# EAGLE design TLV2361_breakout (EAGLE 9.3.1)
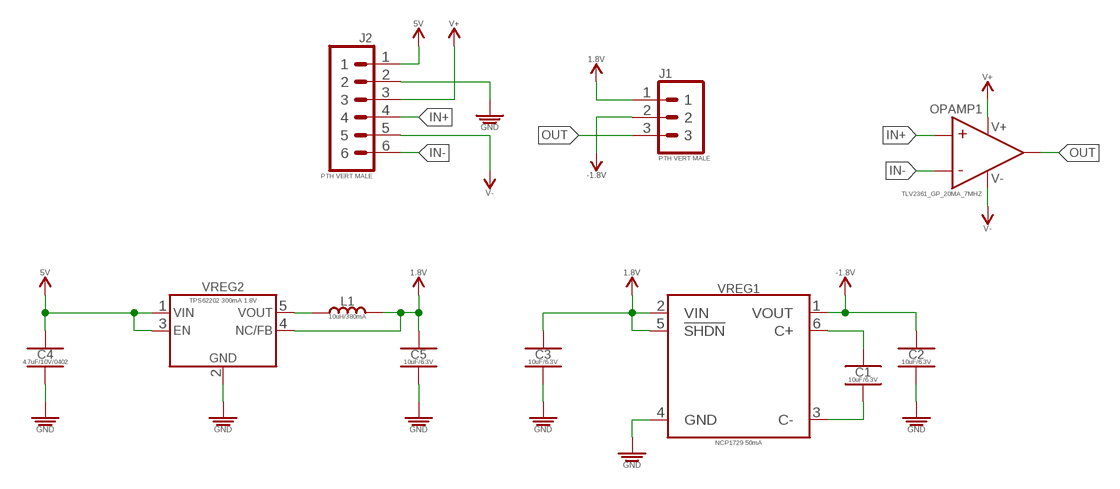
[diagram p0: schematic, sheet 1]

## Parts
C1  10uF/6.3V  10UF_CER_SMD-0402_6.3V-20%  [CAPC1005X55_SMD-0402]
C2  10uF/6.3V  10UF_CER_SMD-0402_6.3V-20%  [CAPC1005X55_SMD-0402]
C3  10uF/6.3V  10UF_CER_SMD-0402_6.3V-20%  [CAPC1005X55_SMD-0402]
C4  4.7uF/10V/0402  4.7UF_CER_SMD-0402_10V-20%  [CAPC1005X55_SMD-0402]
C5  10uF/6.3V  10UF_CER_SMD-0402_6.3V-20%  [CAPC1005X55_SMD-0402]
J1  PTH VERT MALE  1X03_PTH_VERT_MALE_2.54MM  [HDRV3W64P254_1X3_762X254X838B]
J2  PTH VERT MALE  1X06_PTH_VERT_MALE_2.54MM  [HDRV6W64P254_1X6_1524X254X838B]
L1  10uH/380mA  10UH_SMD-0603_0.38A-0.468OHM-10%  [INDC1608X60-0603]
OPAMP1  TLV2361_GP_20MA_7MHZ  [SOT95P280X145-5]
VREG1  NCP1729 50mA  VREG_NCP1729_NEGATIVE_SWITCHED-CAP-INVERTER_50MA  [SOT95P275X100-6]
VREG2  TPS62202 300mA 1.8V  VREG_SWITCHING_TPS6220XTPS62202_300MA_1.8V  [SOT95P280X145-5]

## Nets
1.8V: C3.1 C5.1 J1.1 L1.2 VREG1.2(VIN) VREG1.5(!SHDN) VREG2.4(NC/FB)
5V: C4.1 J2.1 VREG2.1(VIN) VREG2.3(EN)
-1.8V: C2.1 J1.2 VREG1.1(VOUT)
C+: C1.1 VREG1.6(C+)
C-: C1.2 VREG1.3(C-)
GND: C2.2 C3.2 C4.2 C5.2 J2.2 VREG1.4(GND) VREG2.2(GND)
IN+: J2.4 OPAMP1.1(IN+)
IN-: J2.6 OPAMP1.3(IN-)
N$6: L1.1 VREG2.5(VOUT)
OUT: J1.3 OPAMP1.4(OUT)
V+: J2.3 OPAMP1.5(V+)
V-: J2.5 OPAMP1.2(V-)

## Library data of the parts
C1-C3 C5 = _capacitors:10UF; DATASHEET: https://www.murata.com/~/media/webrenewal/support/library/catalog/products/capacitor/mlcc/c02e.ashx; DIST: Digikey; DISTLINK: https://www.digikey.com/products/en?keywords=490-13233-1-ND; DISTPN: 490-13233-1-ND; MFR: Murata Electronics North America; MPN: GRM155C80J106ME11D
C4 = _capacitors:4.7UF; DATASHEET: http://www.samsungsem.com/kr/support/product-search/mlcc/CL05A475MP5NRNC.jsp; DIST: Digikey; DISTLINK: https://www.digikey.com/products/en?keywords=1276-1482-1-ND; DISTPN: 1276-1482-1-ND; MFR: Samsung Electro-Mechanics; MPN: CL05A475MP5NRNC
J1 = _connectors:1X03; DATASHEET: https://drawings-pdf.s3.amazonaws.com/C10436.pdf; DIST: Digikey; DISTLINK: https://www.digikey.com/products/en?keywords=S1012E-03-ND; DISTPN: S1012E-03-ND; MFR: Sullins Connector Solutions; MPN: PEC03SAAN
J2 = _connectors:1X06; DATASHEET: https://drawings-pdf.s3.amazonaws.com/C10436.pdf; DIST: Digikey; DISTLINK: https://www.digikey.com/products/en?keywords=PEC06SAAN; DISTPN: S1012E-06-ND; MFR: Sullins Connector Solutions; MPN: PEC06SAAN
L1 = _inductors:10UH; DATASHEET: http://ds.yuden.co.jp/TYCOMPAS/ut/detail.do?productNo=CBMF1608T100K&fileName=CBMF1608T100K_SS&mode=specSheetDownload; DIST: Digikey; DISTLINK: https://www.digikey.com/products/en?keywords=587-1720-1-ND; DISTPN: 587-1720-1-ND; MFR: Taiyo Yuden; MPN: Taiyo Yuden
OPAMP1 = _op_amps:TLV2361; DATASHEET: http://www.ti.com/lit/ds/symlink/tlv2361.pdf; DIST: Digikey; DISTLINK: https://www.digikey.com/products/en?keywords=296-13745-1-ND; DISTPN: 296-13745-1-ND; MFR: Texas Instruments; MPN: TLV2361IDBVR; VALUR: TLV2361
VREG1 = _ic_power:VREG_NCP1729; DATASHEET: https://www.onsemi.com/pub/Collateral/NCP1729-D.PDF; DIST: Digikey; DISTLINK: https://www.digikey.com/products/en?keywords=NCV1729SN35T1GOSCT-ND; DISTPN: NCV1729SN35T1GOSCT-ND; MFR: ON Semiconductor; MPN: NCV1729SN35T1G
VREG2 = _ic_power:VREG_SWITCHING_TPS6220X; DATASHEET: http://www.ti.com/lit/ds/symlink/tps62200.pdf; DIST: Digikey; DISTLINK: https://www.digikey.com/products/en?keywords=296-16730-1-ND; DISTPN: 296-16730-1-ND; MFR: Texas Instruments; MPN: TPS62202DBVR

## Board
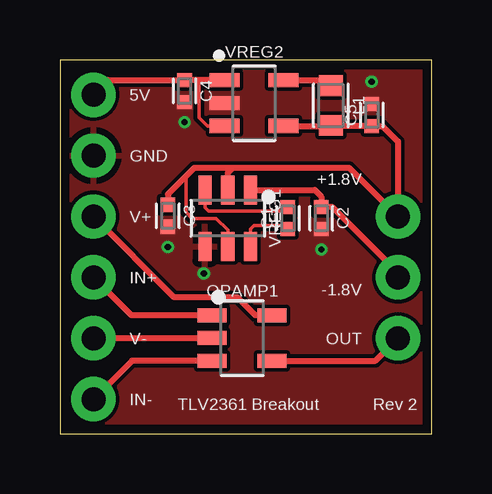
[diagram p1: board, top side]
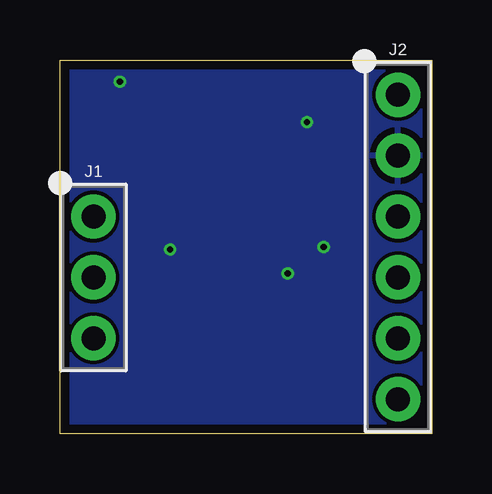
[diagram p2: board, bottom side, seen from below]

Size 15.5 x 15.6 mm. Coordinates in mm from the lower left corner, seen from the top.
Outline: 0,0 15.5,0 15.5,15.6 0,15.6 0,0
Copper layers (1*16): Top 0.035559375mm / dielectric 1.6mm / Bottom 0.035559375mm
Design rules "oshpark-2layer": minimum track width 6mil, minimum drill 10mil, track to track 6mil, track to pad 6mil, pad to pad 6mil, via to via 6mil, smd to smd 6mil, copper to edge 15mil, drill to drill 6mil, minimum pad ring 5mil, minimum via ring 5mil, stop-mask expansion 2.5mil, vias tented up to drill 0mil, thermal gap 10mil

### Footprints (pad centres in the part's own frame; a part is rotated, then mirrored left to right if it is on the bottom)
CAPC1005X55_SMD-0402 = smd 0.585 x 0.612: 1 -0.458,0; 2 0.458,0
HDRV3W64P254_1X3_762X254X838B = drill 1 pad 1.85: 1 -2.54,0; 2 0,0; 3 2.54,0
HDRV6W64P254_1X6_1524X254X838B = drill 1 pad 1.85: 1 -6.35,0; 2 -3.81,0; 3 -1.27,0; 4 1.27,0; 5 3.81,0; 6 6.35,0
INDC1608X60-0603 = smd 0.859 x 1.015: 1 -0.828,0; 2 0.828,0
SOT95P280X145-5 = smd 1.209 x 0.589: 1 -1.253,0.95; 2 -1.253,0; 3 -1.253,-0.95; 4 1.253,-0.95; 5 1.253,0.95
SOT95P275X100-6 = smd 1.212 x 0.552: 1 -1.175,0.95; 2 -1.175,0; 3 -1.175,-0.95; 4 1.175,-0.95; 5 1.175,0; 6 1.175,0.95
SOT95P280X145-5' = smd 1.253 x 0.589: 1 -1.231,0.95; 2 -1.231,0; 3 -1.231,-0.95; 4 1.231,-0.95; 5 1.231,0.95

### Placement (x,y rotation side)
C1  9.5,9 90 top
C2  10.9,9 270 top
C3  4.5,9.1 270 top
C4  5.2,14.3 270 top
C5  13,13.3 90 top
J1  14.1,6.53 270 bottom
J2  1.4,7.8 270 bottom
L1  11.3,13.7 270 top
OPAMP1  7.6,4 0 top
VREG1  7,9 270 top
VREG2  TPS62202 300mA 1.8V  [SOT95P280X145-5']  8.1,13.8 0 top

### Tracks (layer width: path | path; a pad name or v marks a point on that pad's centre or on a via)
1.8V
  Top 0.152: VREG1.5 7,8.5 6.5,8.99 5.5,8.99 5.25,9.25 5.25,10.75
  Top 0.254: VREG2.4 11.28,12.85 L1.2 11.33,12.84 C5.1 13.46,12.84 14.1,12.2 J1.1 12.07,11.1 7.2,11.1 | C3.1 4.5,10 5.25,10.75 5.6,11.1 7.2,11.1 | VREG1.2 7,10.9 7.2,11.1
5V
  Top 0.152: VREG2.3 6.15,12.85 5.8,13.2 5.8,14.76
  Top 0.254: VREG2.1 5.8,14.76 C4.1 2.01,14.76 J2.1
-1.8V
  Top 0.254: VREG1.1 10.62,10.18 10.9,9.9 C2.1 11.37,9.46 14.1,6.73 J1.2
C+
  Top 0.152: VREG1.6 7.95,8.55 8.1,8.7 9.34,8.7 C1.1
C-
  Top 0.152: VREG1.3 6.05,9.45 6.2,9.3 9.34,9.3 C1.2
GND  (via drill 0.25)
  other vias: 4.5,7.8 6,6.7 10.9,7.7 5.2,13 13,14.7
  pour Bottom: 0,0 15.5,0 15.5,15.6 0,15.6
  pour Top: 0,0 15.5,0 15.5,15.6 0,15.6
IN+
  Top 0.254: J2.4 2.98,4.95 OPAMP1.1
IN-
  Top 0.254: J2.6 3,3.05 OPAMP1.3
N$6
  Top 0.254: VREG2.5 11.08,14.75 L1.1
OUT
  Top 0.254: OPAMP1.4 13.16,3.05 J1.3
V+
  Top 0.254: OPAMP1.5 8.15,4.95 7.4,5.7 4.77,5.7 J2.3
V-
  Top 0.254: OPAMP1.2 6.34,3.99 J2.5

### Text on the board
tPlace: 5V | GND | +1.8V | V+ | IN+ | -1.8V | V- | OUT | IN- | TLV2361 Breakout | Rev 2